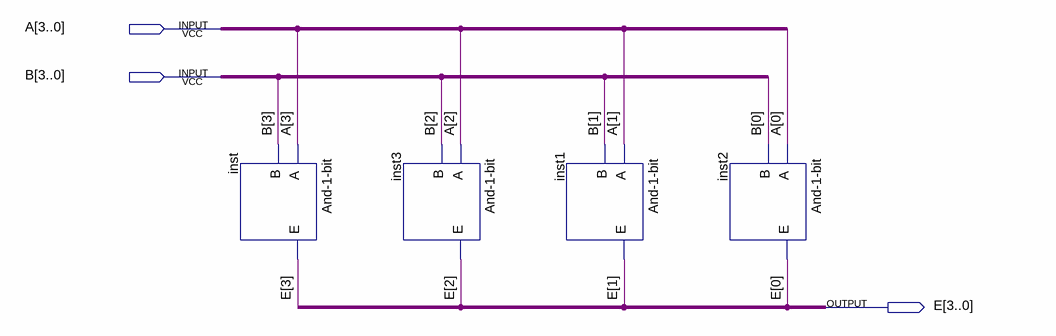
[diagram p0: schematic sheet]
// Quartus schematic And-4-bits.bdf as structural Verilog: 4 symbols, 3 pins
module \And-4-bits  (
  input  [3:0] A,
  input  [3:0] B,
  output [3:0] E
);

  \And-1-bit  inst (.A(A[3]), .B(B[3]), .E(E[3]));
  \And-1-bit  inst3 (.A(A[2]), .B(B[2]), .E(E[2]));
  \And-1-bit  inst1 (.A(A[1]), .B(B[1]), .E(E[1]));
  \And-1-bit  inst2 (.A(A[0]), .B(B[0]), .E(E[0]));
endmodule
